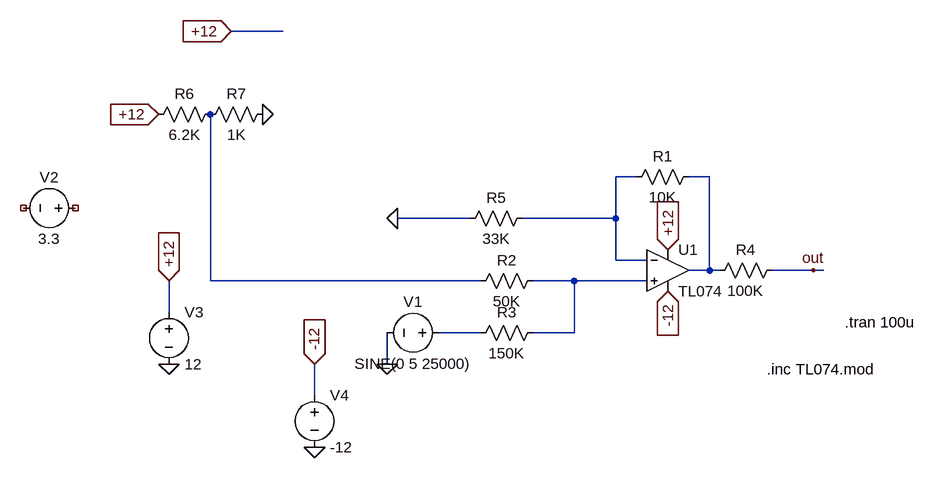
[diagram p0: schematic noninvertingopamp.asc]
noninvertingopamp.asc, the LTspice schematic file:
Version 4
SHEET 1 936 680
WIRE -48 0 -128 0
WIRE 496 224 464 224
WIRE 608 224 576 224
WIRE 240 288 128 288
WIRE 464 288 464 224
WIRE 464 288 320 288
WIRE 464 352 464 288
WIRE 512 352 464 352
WIRE 608 368 608 224
WIRE 608 368 576 368
WIRE 624 368 608 368
WIRE 768 368 704 368
WIRE 784 368 768 368
WIRE -160 384 -160 128
WIRE 256 384 -160 384
WIRE 400 384 336 384
WIRE 512 384 400 384
WIRE -224 432 -224 384
WIRE 256 464 192 464
WIRE 400 464 400 384
WIRE 400 464 336 464
WIRE 112 512 112 464
WIRE 0 560 0 512
FLAG 544 400 -12
IOPIN 544 400 In
FLAG 544 336 +12
IOPIN 544 336 In
FLAG 128 288 0
FLAG 112 512 0
FLAG -80 128 0
FLAG 768 368 out
FLAG -224 512 0
FLAG 0 640 0
FLAG -224 384 +12
IOPIN -224 384 In
FLAG 0 512 -12
IOPIN 0 512 In
FLAG -240 128 +12
IOPIN -240 128 In
FLAG -128 0 +12
IOPIN -128 0 In
SYMBOL Opamps/opamp2 544 304 R0
SYMATTR InstName U1
SYMATTR Value TL074
SYMBOL res 480 240 R270
WINDOW 0 32 56 VTop 2
WINDOW 3 0 56 VBottom 2
SYMATTR InstName R1
SYMATTR Value 10K
SYMBOL res 240 400 R270
WINDOW 0 32 56 VTop 2
WINDOW 3 0 56 VBottom 2
SYMATTR InstName R2
SYMATTR Value 50K
SYMBOL res 352 448 R90
WINDOW 0 0 56 VBottom 2
WINDOW 3 32 56 VTop 2
SYMATTR InstName R3
SYMATTR Value 150K
SYMBOL res 720 352 R90
WINDOW 0 0 56 VBottom 2
WINDOW 3 32 56 VTop 2
SYMATTR InstName R4
SYMATTR Value 100K
SYMBOL voltage 208 464 R90
WINDOW 0 -32 56 VBottom 2
WINDOW 3 32 56 VTop 2
SYMATTR InstName V1
SYMATTR Value SINE(0 5 25000)
SYMATTR Value2 AC 11
SYMBOL voltage -352 272 R90
WINDOW 0 -32 56 VBottom 2
WINDOW 3 32 56 VTop 2
SYMATTR InstName V2
SYMATTR Value 3.3
SYMBOL voltage -224 416 R0
SYMATTR InstName V3
SYMATTR Value 12
SYMBOL voltage 0 544 R0
SYMATTR InstName V4
SYMATTR Value -12
SYMBOL res 224 304 R270
WINDOW 0 32 56 VTop 2
WINDOW 3 0 56 VBottom 2
SYMATTR InstName R5
SYMATTR Value 33K
SYMBOL res -256 144 R270
WINDOW 0 32 56 VTop 2
WINDOW 3 0 56 VBottom 2
SYMATTR InstName R6
SYMATTR Value 6.2K
SYMBOL res -176 144 R270
WINDOW 0 32 56 VTop 2
WINDOW 3 0 56 VBottom 2
SYMATTR InstName R7
SYMATTR Value 1K
TEXT 696 520 Left 2 !.inc TL074.mod
TEXT 816 448 Left 2 !.tran 100u

The netlist it stands for:
* noninvertingopamp.asc
XU1 N004 N001 +12 -12 N002 TL074  ; pins In+ In- V+ V- OUT
R1 N001 N002 10K
R2 N003 N004 50K
R3 N004 N005 150K
R4 out N002 100K
V1 N005 0 SINE(0 5 25000) AC 11
V2 NC_01 NC_02 3.3
V3 +12 0 12
V4 -12 0 -12
R5 0 N001 33K
R6 +12 N003 6.2K
R7 N003 0 1K
.inc TL074.mod
.tran 100u
.backanno
.end